# EAGLE schematic uBeep_PSU (EAGLE 9.4.2)
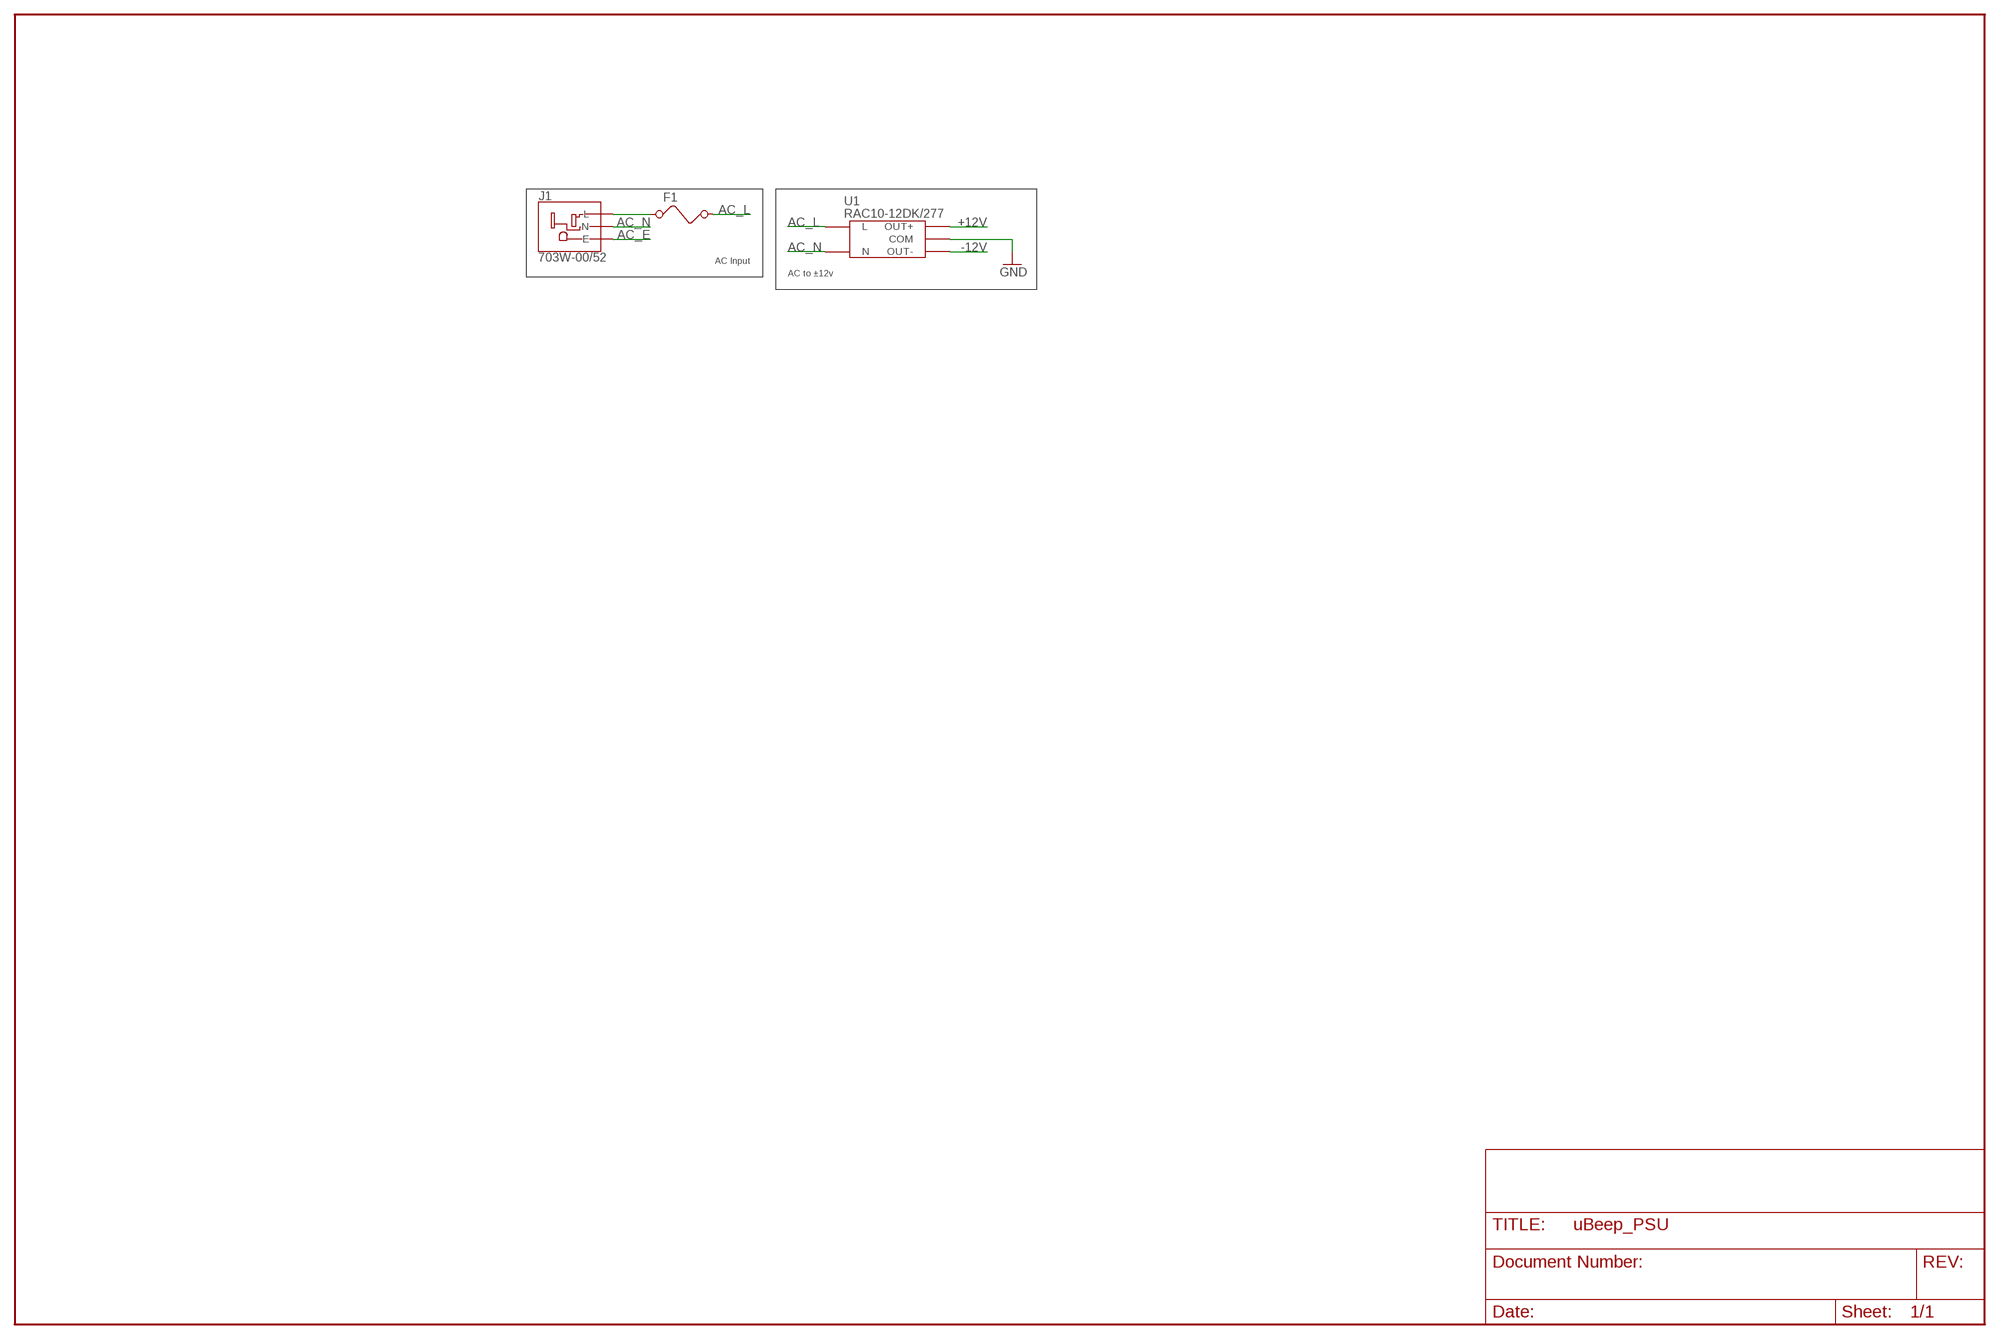
[diagram p0: schematic, sheet 1]

## Parts
F1  0PTF0075P  [0PTF0075P]
J1  703W-00/52  [703W-00/52]
U1  RAC10-12DK/277  RAC10-DK/277  [RAC10-DK/277]

## Nets
+12V: U1.P$5(OUT+)
-12V: U1.P$3(OUT-)
AC_E: J1.E
AC_L: F1.2 U1.P$2(L)
AC_N: J1.N U1.P$1(N)
GND: U1.P$4(COM)
N$1: F1.1 J1.L

## Notes on the sheet
- AC Input
- AC to ±12v

## Library data of the parts
F1 = roomready:0PTF0075P
J1 = roomready:703W-00/52
U1 = roomready:RAC10-DK/277